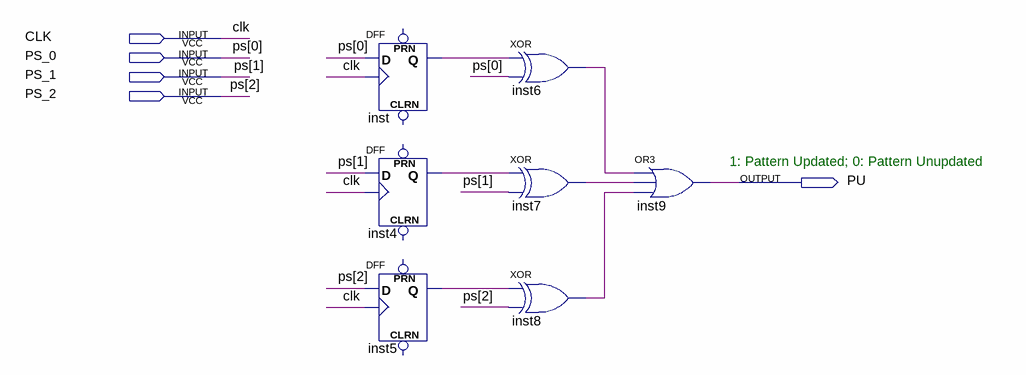
[diagram p0: schematic sheet]
// Quartus schematic UPDATE_CHECK.bdf as structural Verilog: 7 symbols, 5 pins
module UPDATE_CHECK (
  input  CLK,
  input  PS_0,
  input  PS_1,
  input  PS_2,
  output PU
);

  wire inst4_q, inst5_q, inst6_out, inst7_out, inst8_out, inst_q;

  DFF inst (.CLK(CLK), .D(PS_0), .Q(inst_q));  // open: CLRN, PRN
  DFF inst4 (.CLK(CLK), .D(PS_1), .Q(inst4_q));  // open: CLRN, PRN
  DFF inst5 (.CLK(CLK), .D(PS_2), .Q(inst5_q));  // open: CLRN, PRN
  xor inst6 (inst6_out, inst_q, PS_0);
  xor inst7 (inst7_out, inst4_q, PS_1);
  xor inst8 (inst8_out, inst5_q, PS_2);
  or inst9 (PU, inst6_out, inst7_out, inst8_out);

  // Other names for the same wires on the sheet: ps[2:0] = {PS_2, PS_1, PS_0}

  // Notes on the sheet:
  //   1: Pattern Updated; 0: Pattern Unupdated
endmodule
